# EAGLE design motorboard_2017 (EAGLE 8.4.3)
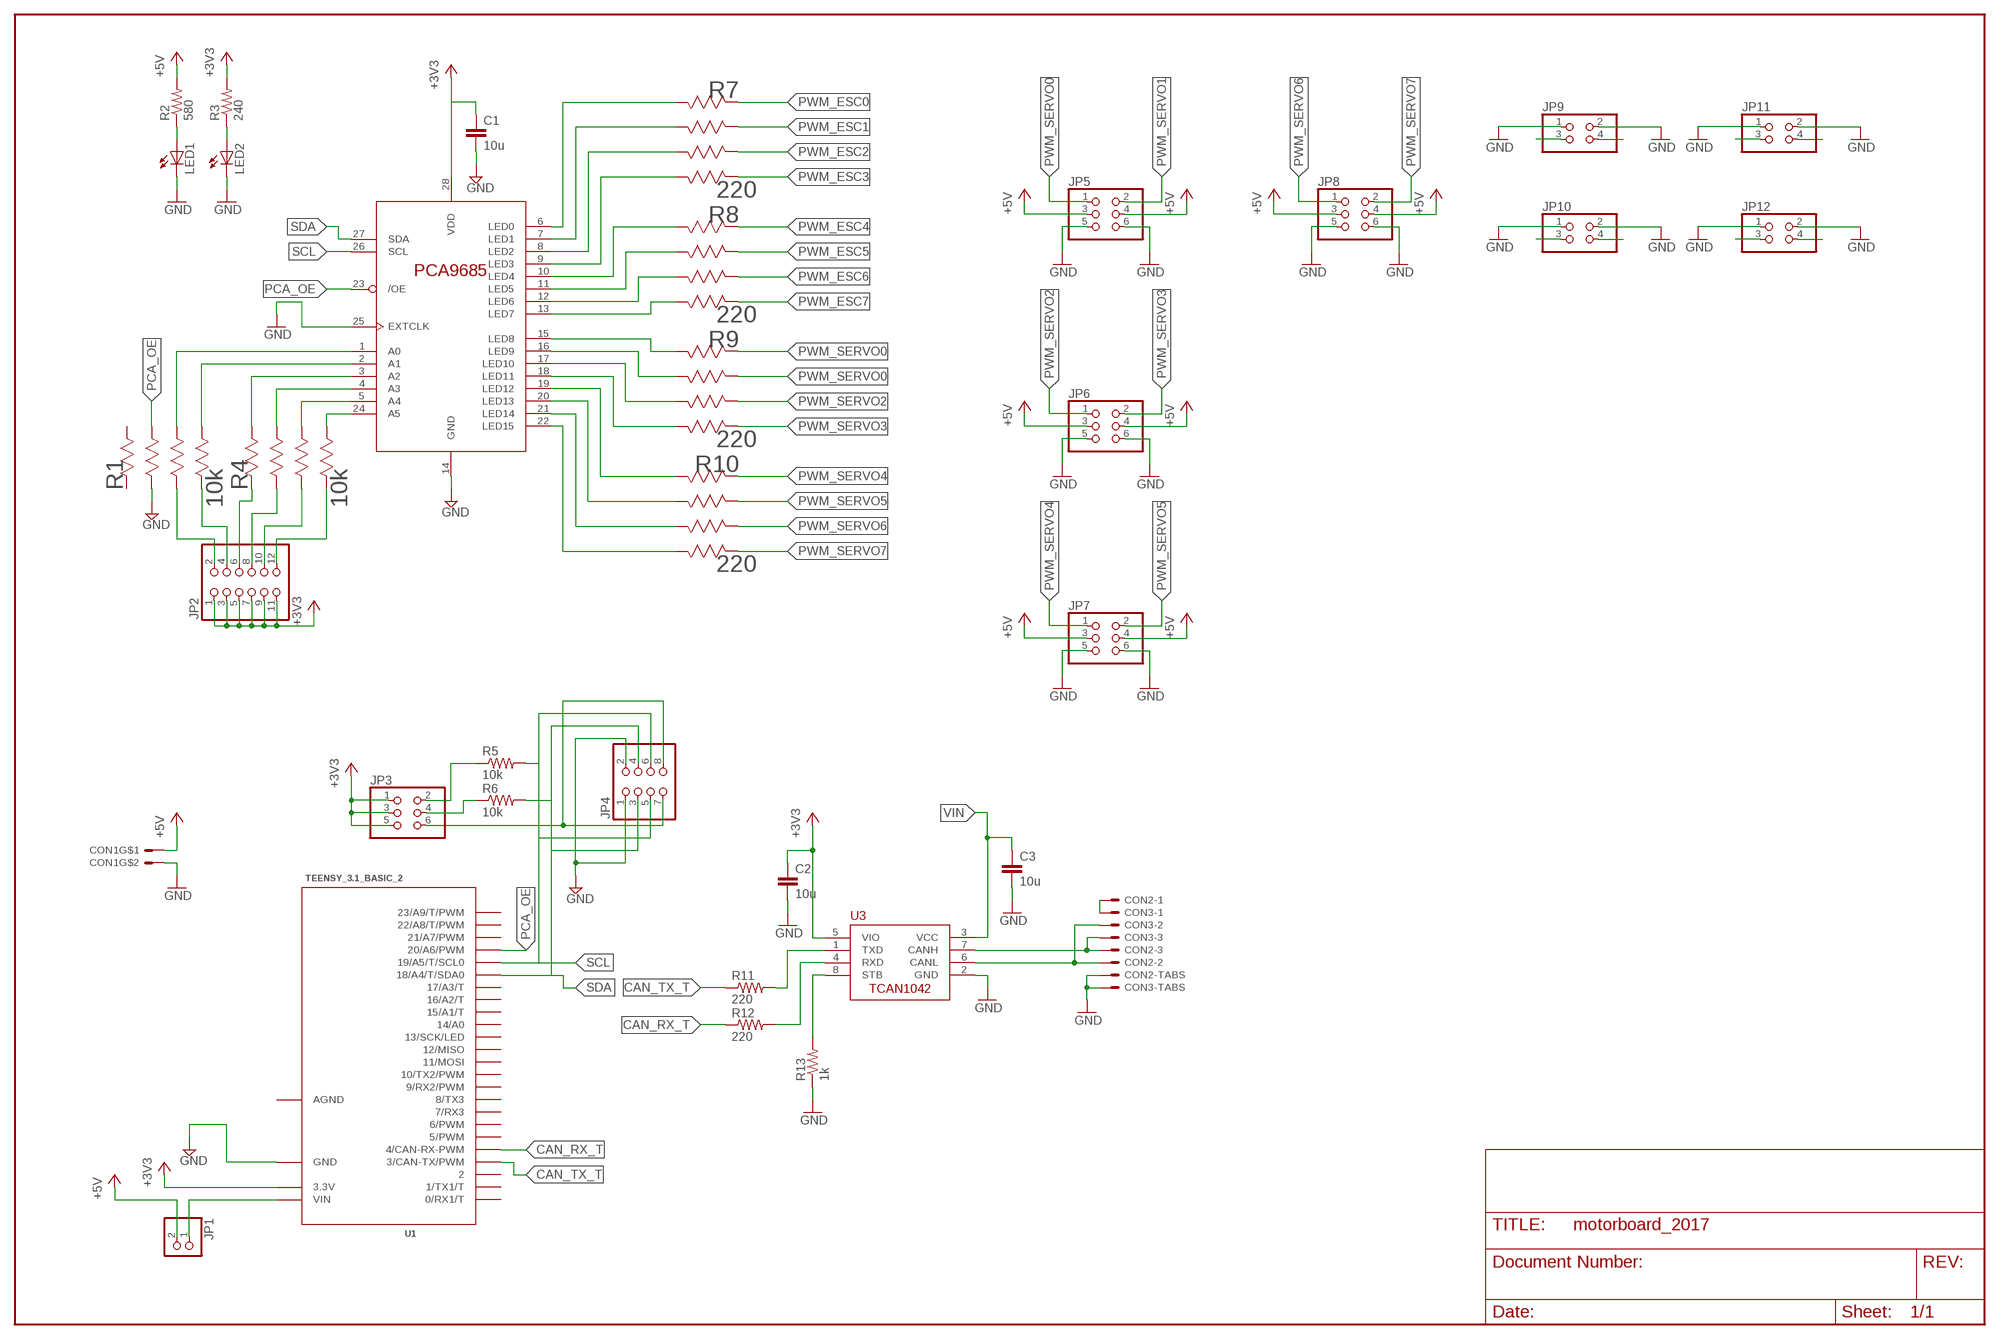
[diagram p0: schematic, sheet 1]

## Parts
C1  10u  C-EUC0805  [C0805]
C2  10u  C-EUC0805  [C0805]
C3  10u  C-EUC0805  [C0805]
CON1  MOLEX_5566-2  [5566-2]
CON2  SM03B-GHS-TB  [SM03B-GHS-TB]
CON3  SM03B-GHS-TB  [SM03B-GHS-TB]
JP1  PINHD-1X2  [1X02]
JP2  PINHD-2X6  [2X06]
JP3  PINHD-2X3  [2X03]
JP4  PINHD-2X4  [2X04]
JP5  PINHD-2X3  [2X03]
JP6  PINHD-2X3  [2X03]
JP7  PINHD-2X3  [2X03]
JP8  PINHD-2X3  [2X03]
JP9  PINHD-2X2  [2X02]
JP10  PINHD-2X2  [2X02]
JP11  PINHD-2X2  [2X02]
JP12  PINHD-2X2  [2X02]
LED1  LEDCHIPLED_1206  [CHIPLED_1206]
LED2  LEDCHIPLED_1206  [CHIPLED_1206]
R1  10k  EXB-V8V221JVEXBV8V-M  [EXBV8V-M]
R2  580  R-US_R1206  [R1206]
R3  240  R-US_R1206  [R1206]
R4  10k  EXB-V8V221JVEXBV8V-M  [EXBV8V-M]
R5  10k  R-US_R1206  [R1206]
R6  10k  R-US_R1206  [R1206]
R7  220  EXB-V8V221JVEXBV8V-M  [EXBV8V-M]
R8  220  EXB-V8V221JVEXBV8V-M  [EXBV8V-M]
R9  220  EXB-V8V221JVEXBV8V-M  [EXBV8V-M]
R10  220  EXB-V8V221JVEXBV8V-M  [EXBV8V-M]
R11  220  R-US_R0805  [R0805]
R12  220  R-US_R0805  [R0805]
R13  1k  R-US_R0805  [R0805]
U1  TEENSY_3.1_BASIC_2  [TEENSY_3.1_BASIC_2]
U2  PCA9685PW  [TSSOP28]
U3  TCAN1042HVDR  [SO-8]

## Nets
+3V3: C1.1 C2.1 JP2.1 JP2.3 JP2.5 JP2.7 JP2.9 JP2.11 JP3.1 JP3.3 JP3.5 R3.2 U1.3.3V U2.28(VDD) U3.5(VIO)
+5V: CON1.1 JP1.2 JP5.3 JP5.4 JP6.3 JP6.4 JP7.3 JP7.4 JP8.3 JP8.4 R2.2
A0: R1.6 U2.1(A0)
A0+1: JP2.2 R1.3
A1: R1.5 U2.2(A1)
A1+1: JP2.4 R1.4
A2: R4.8 U2.3(A2)
A2+1: JP2.6 R4.1
A3: R4.7 U2.4(A3)
A3+1: JP2.8 R4.2
A4: R4.6 U2.5(A4)
A4+1: JP2.10 R4.3
A5: R4.5 U2.24(A5)
A5+1: JP2.12 R4.4
CAN_RX1: R12.2 U3.4(RXD)
CAN_RX_T: R12.1 U1.4(4/CAN-RX-PWM)
CAN_TX2: R11.2 U3.1(TXD)
CAN_TX_T: R11.1 U1.3(3/CAN-TX/PWM)
CANH1: CON2.P$3 CON3.P$3 U3.7(CANH)
CANL1: CON2.P$2 CON3.P$2 U3.6(CANL)
CANSH1: CON2.P$1 CON3.P$1
GND: C1.2 C2.2 C3.2 CON1.2 CON2.P$4 CON2.P$5 CON3.P$4 CON3.P$5 JP4.1 JP4.2 JP5.5 JP5.6 JP6.5 JP6.6 JP7.5 JP7.6 JP8.5 JP8.6 JP9.1 JP9.2 JP10.1 JP10.2 JP11.1 JP11.2 JP12.1 JP12.2 LED1.C LED2.C R1.2 R13.1 U1.GND U2.14(GND) U2.25(EXTCLK) U3.2(GND)
I2C_3V1: JP3.6 JP4.7 JP4.8
N$1: LED2.A R3.1
N$2: LED1.A R2.1
PCA_OE: R1.7 U1.20/A6(20/A6/PWM) U2.23(/OE)
PWM_CH0: R7.8 U2.6(LED0)
PWM_CH1: R7.7 U2.7(LED1)
PWM_CH2: R7.6 U2.8(LED2)
PWM_CH3: R7.5 U2.9(LED3)
PWM_CH4: R8.8 U2.10(LED4)
PWM_CH5: R8.7 U2.11(LED5)
PWM_CH6: R8.6 U2.12(LED6)
PWM_CH7: R8.5 U2.13(LED7)
PWM_CH8: R9.8 U2.15(LED8)
PWM_CH9: R9.7 U2.16(LED9)
PWM_CH10: R9.6 U2.17(LED10)
PWM_CH11: R9.5 U2.18(LED11)
PWM_CH12: R10.8 U2.19(LED12)
PWM_CH13: R10.7 U2.20(LED13)
PWM_CH14: R10.6 U2.21(LED14)
PWM_CH15: R10.5 U2.22(LED15)
PWM_ESC0: JP12.4 R7.1
PWM_ESC1: JP12.3 R7.2
PWM_ESC2: JP9.4 R7.3
PWM_ESC3: JP9.3 R7.4
PWM_ESC4: JP11.4 R8.1
PWM_ESC5: JP11.3 R8.2
PWM_ESC6: JP10.4 R8.3
PWM_ESC7: JP10.3 R8.4
PWM_SERVO0: JP5.1 R9.1
PWM_SERVO1: JP5.2 R9.2
PWM_SERVO2: JP6.1 R9.3
PWM_SERVO3: JP6.2 R9.4
PWM_SERVO4: JP7.1 R10.1
PWM_SERVO5: JP7.2 R10.2
PWM_SERVO6: JP8.1 R10.3
PWM_SERVO7: JP8.2 R10.4
SCL: JP4.5 JP4.6 R5.2 U1.19/A5(19/A5/T/SCL0) U2.26(SCL)
SCL_3V1: JP3.2 R5.1
SDA: JP4.3 JP4.4 R6.2 U1.18/A4(18/A4/T/SDA0) U2.27(SDA)
SDA_3V1: JP3.4 R6.1
STB1: R13.2 U3.8(STB)
VIN: C3.1 JP1.1 U1.VIN U3.3(VCC)
Unconnected: R1.1 R1.8 U1.0(0/RX1/T) U1.1(1/TX1/T) U1.2 U1.5(5/PWM) U1.6(6/PWM) U1.7(7/RX3) U1.8(8/TX3) U1.9(9/RX2/PWM) U1.10(10/TX2/PWM) U1.11(11/MOSI) U1.12(12/MISO) U1.13(13/SCK/LED) U1.14/A0 U1.15/A1(15/A1/T) U1.16/A2(16/A2/T) U1.17/A3(17/A3/T) U1.21/A7(21/A7/PWM) U1.22/A8(22/A8/T/PWM) U1.23/A9(23/A9/T/PWM)

## Power pins joined to a net without a drawn wire
AGND: U1.AGND

## Library data of the parts
C1-C3 = rcl:C-EU: CAPACITOR, European symbol
CON1 = ARVP:MOLEX_5566-2
CON2 CON3 = ARVP:SM03B-GHS-TB
JP1 = pinhead:PINHD-1X2: PIN HEADER
JP2 = pinhead:PINHD-2X6: PIN HEADER
JP3 JP5-JP8 = pinhead:PINHD-2X3: PIN HEADER
JP4 = pinhead:PINHD-2X4: PIN HEADER
JP9-JP12 = pinhead:PINHD-2X2: PIN HEADER
LED1 LED2 = led:LED: LED OSRAM: - CHIPLED LG R971, LG N971, LY N971, LG Q971, LY Q971, LO R971, LY R971 LH N974, LH R974 LS Q976, LO Q976, LY Q976 LO Q996 - Hyper CHIPLED LW Q18S LB Q993, LB Q99A, LB R99A - SideLED LS A670, LO A670, LY A670, LG A670, LP A670 LB A673, LV A673, LT A673, LW A673 LH A674 LY A675 LS A676, LA A676, LO A676, LY A676, LW A676 LS A679, LY A679, LG A679 - Hyper Micro SIDELED® LS Y876, LA Y876, LO Y876, LY Y876 LT Y87S - SmartLED LW L88C, LW L88S LB L89C, LB L89S, LG L890 LS L89K, LO L89K, LY L89K LS L896, LA L896, LO L896, LY L896 - TOPLED LS T670, LO T670, LY T670, LG T670, LP T670 LSG T670, LSP T670, LSY T670, LOP T670, LYG T670 LG T671, LOG T671, LSG T671 LB T673, LV T673, LT T673, LW T673 LH T674 LS T676, LA T676, LO T676, LY T676, LB T676, LH T676, LSB T676, LW T676 LB T67C, LV T67C, LT T67C, LS T67K, LO T67K, LY T67K, LW E67C LS E67B, LA E67B, LO E67B, LY E67B, LB E67C, LV E67C, LT E67C LW T67C LS T679, LY T679, LG T679 LS T770, LO T770, LY T770, LG T770, LP T770 LB T773, LV T773, LT T773, LW T773 LH T774 LS E675, LA E675, LY E675, LS T675 LS T776, LA T776, LO T776, LY T776, LB T776 LHGB T686 LT T68C, LB T68C - Hyper Mini TOPLED® LB M676 - Mini TOPLED Santana® LG M470 LS M47K, LO M47K, LY M47K Source: http://www.osram.convergy.de LUXEON: - LUMILED® LXK2-PW12-R00, LXK2-PW12-S00, LXK2-PW14-U00, LXK2-PW14-V00 LXK2-PM12-R00, LXK2-PM12-S00, LXK2-PM14-U00 LXK2-PE12-Q00, LXK2-PE12-R00, LXK2-PE12-S00, LXK2-PE14-T00, LXK2-PE14-U00 LXK2-PB12-K00, LXK2-PB12-L00, LXK2-PB12-M00, LXK2-PB14-N00, LXK2-PB14-P00, LXK2-PB14-Q00 LXK2-PR12-L00, LXK2-PR12-M00, LXK2-PR14-Q00, LXK2-PR14-R00 LXK2-PD12-Q00, LXK2-PD12-R00, LXK2-PD12-S00 LXK2-PH12-R00, LXK2-PH12-S00 LXK2-PL12-P00, LXK2-PL12-Q00, LXK2-PL12-R00 Source: www.luxeon.com KINGBRIGHT: KA-3528ASYC Source: www.kingbright.com
R1 R4 R7-R10 = ARVP:EXB-V8V221JV; MANUFACTURER_PART_NUMBER: EXBV8V221JV; VENDOR: Panasonic
R2 R3 R5 R6 R11-R13 = rcl:R-US_: RESISTOR, American symbol
U1 = Teensy_3_Series_Board_v1.0:TEENSY_3.1_BASIC_2: Footprint for Teensy 3.1 board using all pin connections on the outer perimeter
U2 = dropper_torpedo_v3:PCA9685
U3 = ARVP:TCAN1042HVDR

## Net classes
1 net1: clearance 0.203 mm to class 0

## Board
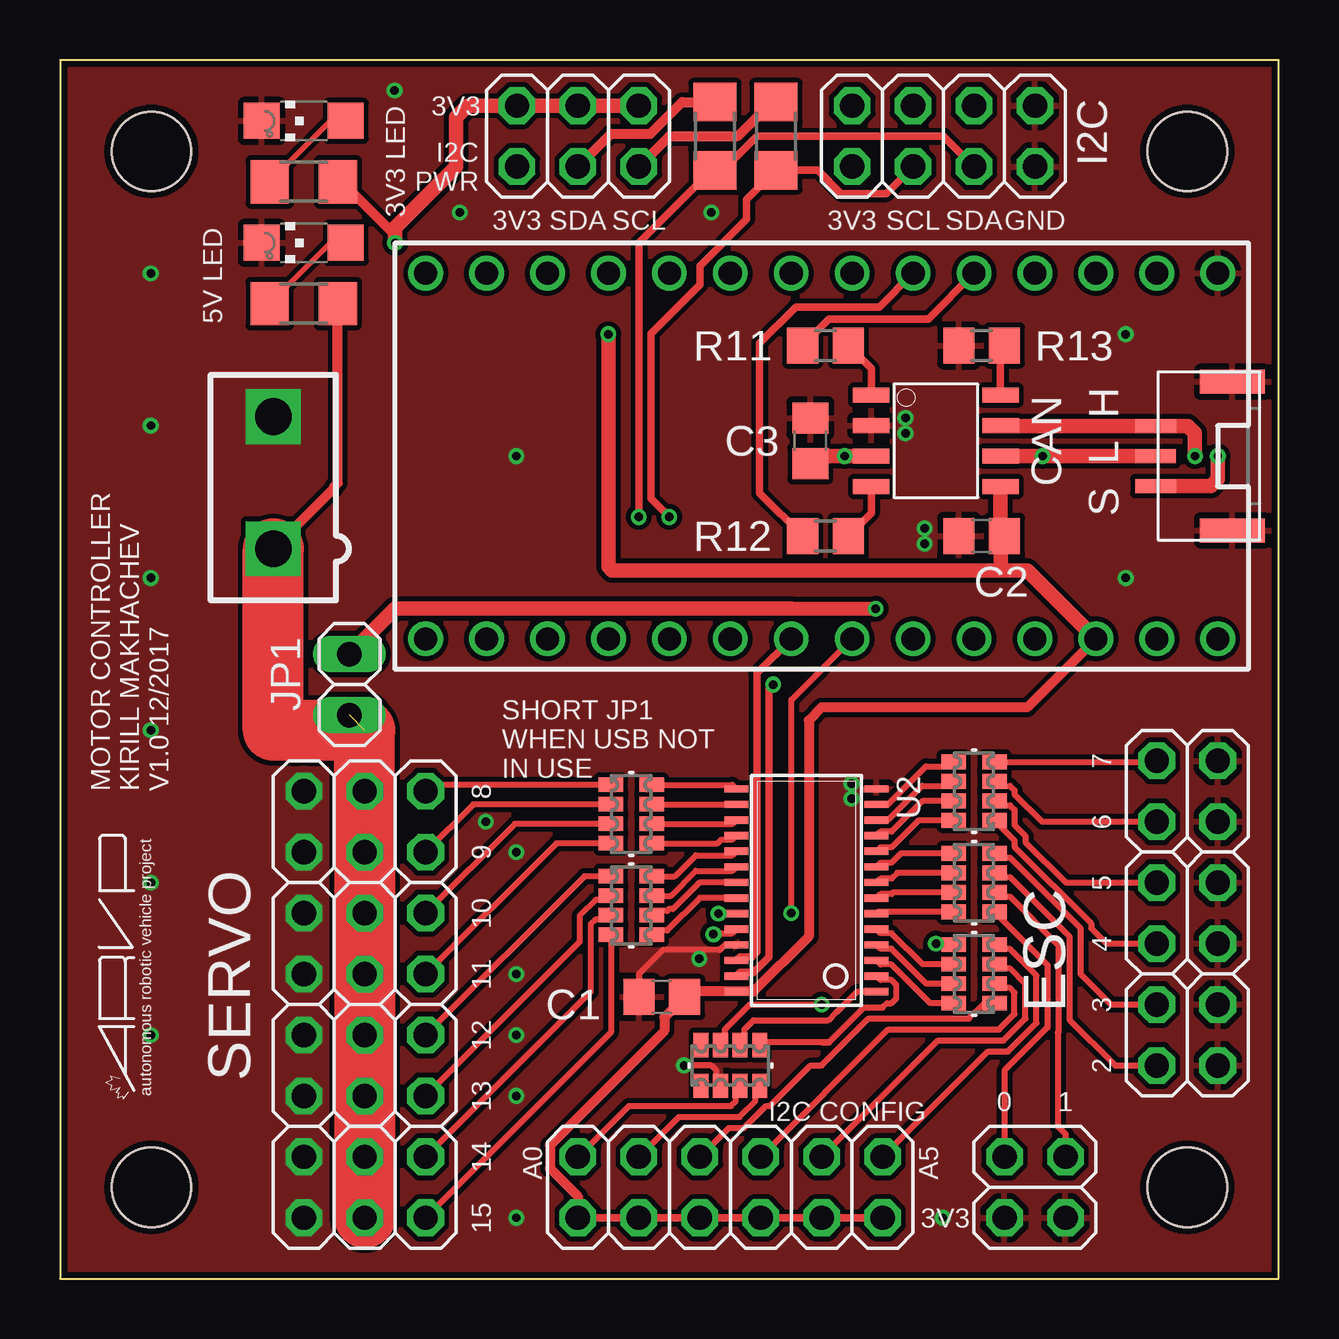
[diagram p1: board, top side]
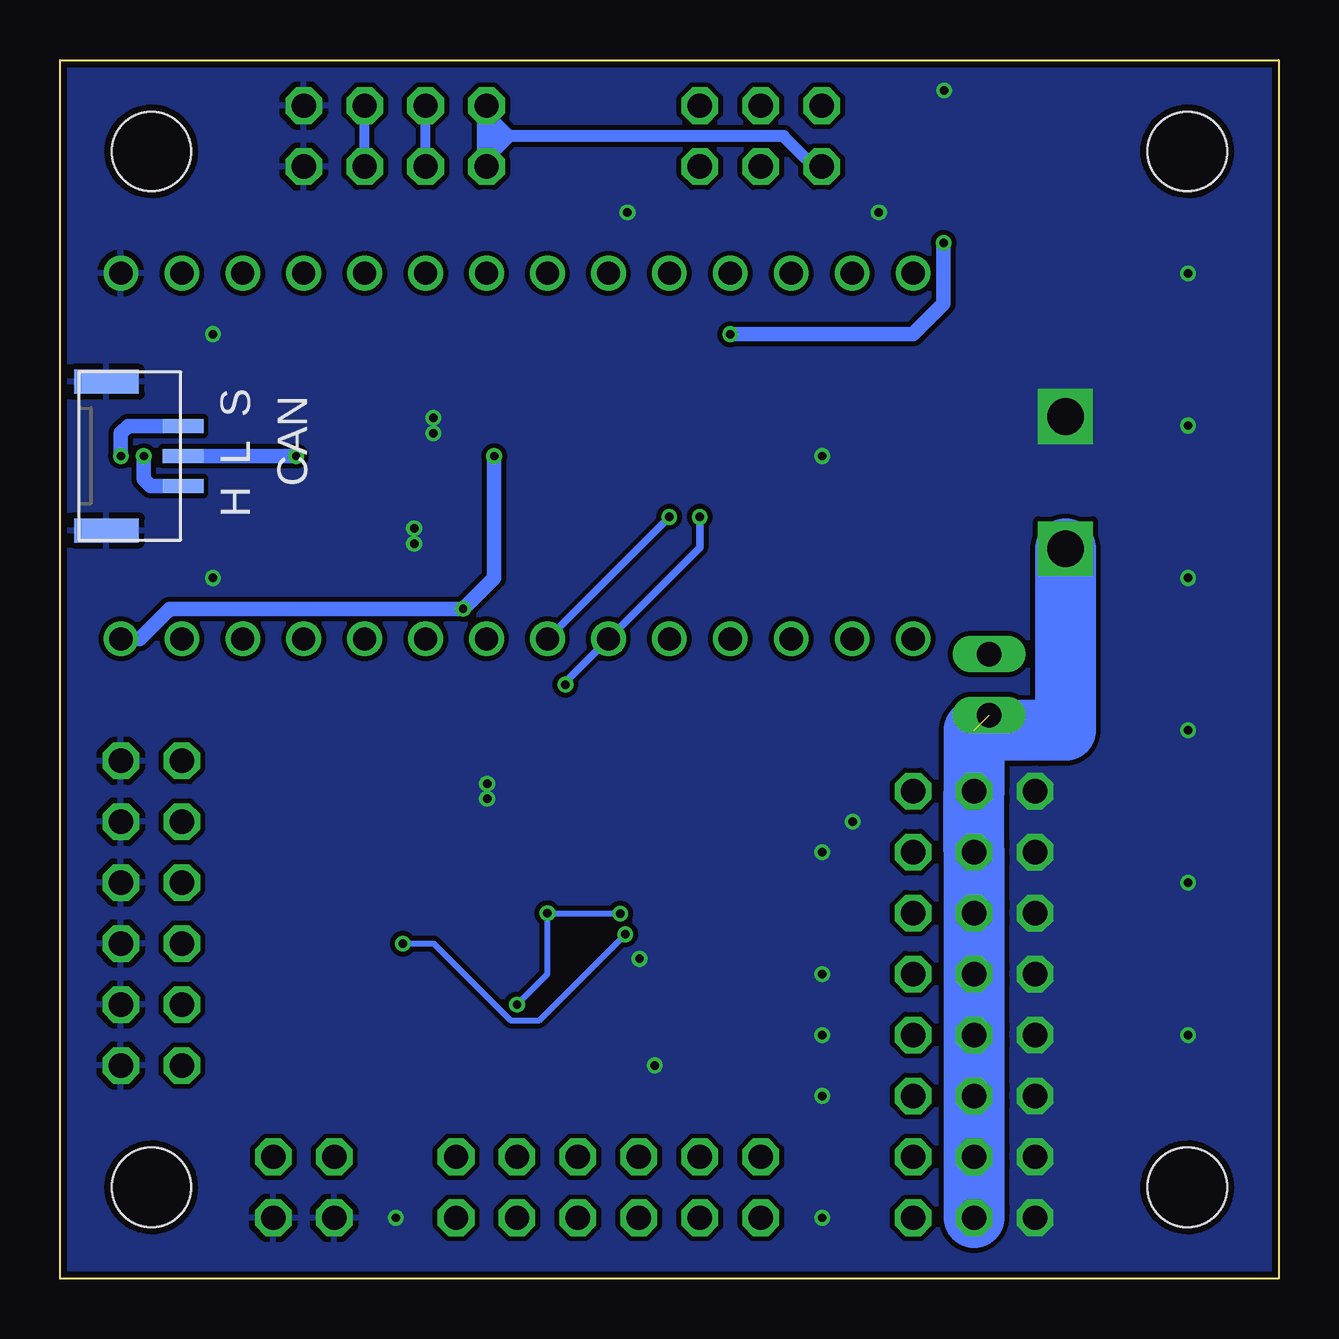
[diagram p2: board, bottom side, seen from below]

Size 50.8 x 50.8 mm. Coordinates in mm from the lower left corner, seen from the top.
Outline: 0,0 50.8,0 50.8,50.8 0,50.8 0,0
Copper layers (1*16): Top 0.035mm / dielectric 1.5mm / Bottom 0.035mm
Design rules "ITEADstudioDRC": minimum track width 6mil, minimum drill 12mil, track to track 8mil, track to pad 8mil, pad to pad 8mil, via to via 8mil, smd to smd 0mil, copper to edge 10mil, drill to drill 10mil, minimum pad ring 6mil, minimum via ring 6mil, stop-mask expansion 2mil, vias tented up to drill 100mil, thermal gap 10mil
Milling: 4 lines

### Footprints (pad centres in the part's own frame; a part is rotated, then mirrored left to right if it is on the bottom)
C0805 = smd 1.3 x 1.5: 1 -0.95,0; 2 0.95,0
5566-2 = drill 1.524 square: 1 0,-2.756; 2 0,2.756
SM03B-GHS-TB = smd 0.6 x 1.7: P$1 -1.25,0.85; P$2 0,0.85; P$3 1.25,0.85 | smd 1 x 2.7: P$4 -3.1,-2.35; P$5 3.1,-2.35
1X02 = drill 1.016 long: 1 -1.27,0; 2 1.27,0
2X06 = drill 1.016 octagon: 1 -6.35,-1.27; 2 -6.35,1.27; 3 -3.81,-1.27; 4 -3.81,1.27; 5 -1.27,-1.27; 6 -1.27,1.27; 7 1.27,-1.27; 8 1.27,1.27; 9 3.81,-1.27; 10 3.81,1.27; 11 6.35,-1.27; 12 6.35,1.27
2X03 = drill 1.016 octagon: 1 -2.54,-1.27; 2 -2.54,1.27; 3 0,-1.27; 4 0,1.27; 5 2.54,-1.27; 6 2.54,1.27
2X04 = drill 1.016 octagon: 1 -3.81,-1.27; 2 -3.81,1.27; 3 -1.27,-1.27; 4 -1.27,1.27; 5 1.27,-1.27; 6 1.27,1.27; 7 3.81,-1.27; 8 3.81,1.27
2X02 = drill 1.016 octagon: 1 -1.27,-1.27; 2 -1.27,1.27; 3 1.27,-1.27; 4 1.27,1.27
CHIPLED_1206 = smd 1.5 x 1.5: A 0,-1.75; C 0,1.75
EXBV8V-M = smd 1.016 x 0.61: 1 -0.851,1.219; 2 -0.851,0.406; 3 -0.851,-0.406; 4 -0.851,-1.219; 5 0.851,-1.219; 6 0.851,-0.406; 7 0.851,0.406; 8 0.851,1.219
R1206 = smd 1.6 x 1.803: 1 -1.422,0; 2 1.422,0
R0805 = smd 1.3 x 1.5: 1 -0.95,0; 2 0.95,0
TEENSY_3.1_BASIC_2 = drill 0.965: 0 -7.62,13.97; 1 -7.62,11.43; 2 -7.62,8.89; 3 -7.62,6.35; 3.3V 7.62,11.43; 4 -7.62,3.81; 5 -7.62,1.27; 6 -7.62,-1.27; 7 -7.62,-3.81; 8 -7.62,-6.35; 9 -7.62,-8.89; 10 -7.62,-11.43; 11 -7.62,-13.97; 12 -7.62,-16.51; 13 7.62,-16.51; 14/A0 7.62,-13.97; 15/A1 7.62,-11.43; 16/A2 7.62,-8.89; 17/A3 7.62,-6.35; 18/A4 7.62,-3.81; 19/A5 7.62,-1.27; 20/A6 7.62,1.27; 21/A7 7.62,3.81; 22/A8 7.62,6.35; 23/A9 7.62,8.89; AGND 7.62,13.97; GND -7.62,16.51; VIN 7.62,16.51
TSSOP28 = smd 0.305 x 0.991: 1 -4.225,-2.918; 2 -3.575,-2.918; 3 -2.925,-2.918; 4 -2.275,-2.918; 5 -1.625,-2.918; 6 -0.975,-2.918; 7 -0.325,-2.918; 8 0.325,-2.918; 9 0.975,-2.918; 10 1.625,-2.918; 11 2.275,-2.918; 12 2.925,-2.918; 13 3.575,-2.918; 14 4.225,-2.918; 15 4.225,2.918; 16 3.575,2.918; 17 2.925,2.918; 18 2.275,2.918; 19 1.625,2.918; 20 0.975,2.918; 21 0.325,2.918; 22 -0.325,2.918; 23 -0.975,2.918; 24 -1.625,2.918; 25 -2.275,2.918; 26 -2.925,2.918; 27 -3.575,2.918; 28 -4.225,2.918
SO-8 = smd 1.524 x 0.61: 1 -2.692,1.905; 2 -2.692,0.635; 3 -2.692,-0.635; 4 -2.692,-1.905; 5 2.692,-1.905; 6 2.692,-0.635; 7 2.692,0.635; 8 2.692,1.905
STAND-OFF = hole 3.302: 0,0

### Placement (x,y rotation side)
C1  25.08,11.75 180 top
C2  38.42,30.96 180 top
C3  31.27,34.93 90 top
CON1  8.89,33.18 0 top
CON2  46.51,34.29 90 top
CON3  46.51,34.29 270 bottom
JP1  12.06,24.77 270 top
JP2  27.94,3.81 0 top
JP3  21.59,47.62 180 top
JP4  36.83,47.62 180 top
JP5  12.7,19.05 180 top
JP6  12.7,13.97 180 top
JP7  12.7,8.89 180 top
JP8  12.7,3.81 180 top
JP9  46.99,10.16 180 top
JP10  46.99,20.32 180 top
JP11  46.99,15.24 180 top
JP12  40.64,3.81 90 top
LED1  10.16,43.18 90 top
LED2  10.16,48.26 90 top
R1  27.94,8.89 90 top
R2  10.16,40.64 0 top
R3  10.16,45.72 0 top
R4  38.1,12.7 180 top
R5  29.84,47.62 270 top
R6  27.3,47.62 270 top
R7  38.1,16.51 180 top
R8  38.1,20.32 180 top
R9  23.81,19.37 0 top
R10  23.81,15.56 0 top
R11  31.91,38.89 0 top
R12  31.91,30.96 0 top
R13  38.42,38.89 0 top
U1  31.75,34.29 270 top
U2  31.11,16.19 90 top
U3  36.51,34.93 0 top
U$1  [LOGO2]  3.81,7.62 90 top
U$2  [STAND-OFF]  46.99,3.81 0 top
U$3  [STAND-OFF]  3.81,3.81 0 top
U$4  [STAND-OFF]  3.81,46.99 0 top
U$5  [STAND-OFF]  46.99,46.99 0 top
U$11  [LETTER_L]  -107.95,-78.74 0 top  (outside the outline)
U$12  [DOCFIELD]  39.37,-78.74 0 top  (outside the outline)

### Tracks (layer width: path | path; a pad name or v marks a point on that pad's centre or on a via)
+3V3  (via drill 0.35)
  Top 0.254: C1.1 26.25,11.97 26.35,11.97 U2.28
  Top 0.305: JP2.1 JP2.3 JP2.5 JP2.7 JP2.9 JP2.11
  Top 0.406: U1.3.3V 40.32,23.81 31.75,23.81 31.21,23.28 31.21,14.28 28.91,11.97 26.35,11.97 | C1.1 25.19,10.9 25.19,10.33 20.42,5.56 20.42,4.6 21.59,3.43 JP2.1 | v13.97,43.18 13.97,43.5 11.75,45.72 R3.2
  Top 0.61: v13.97,43.18 13.97,43.82 16.51,46.36 16.51,48.42 16.99,48.9 JP3.5 JP3.3 JP3.1 | 39.2,31.12 U3.5 | 39.2,31.12 C2.1 39.21,30.8 39.21,29.53 | 39.2,30.96 39.2,31.12 | U1.3.3V 40.32,29.53 39.21,29.53 | 39.21,29.53 23.02,29.53 22.86,29.69 v22.86,39.37
  Bottom 0.61: v13.97,43.18 13.97,40.64 15.24,39.37 v22.86,39.37
+5V  (1 unrouted)
  Top 0.406: CON1.1 11.43,32.96 11.43,33.02 11.58,33.17 R2.2
  Top 2.54: JP8.4 JP8.3 JP7.4 JP7.3 JP6.4 JP6.3 JP5.4 JP5.3 12.7,22.86 8.89,22.86 CON1.1
  Bottom 2.54: JP8.4 JP8.3 JP7.4 JP7.3 JP6.4 JP6.3 JP5.4 JP5.3 12.7,22.86 8.89,22.86 CON1.1
A0
  Top 0.254: R1.6 28.52,9.92 28.52,10.39 28.91,10.77 32.02,10.77 32.36,11.11 32.39,11.11 33.24,11.97 U2.1
A0+1
  Top 0.254: R1.3 28.17,7.86 28.17,7.39 27.98,7.2 23.71,7.2 JP2.2
A1
  Top 0.254: R1.5 29.26,9.84 31.75,9.84 | 32.06,9.84 31.75,9.84 | 31.75,9.84 32.06,9.84 | 32.06,9.84 33.52,11.3 34.29,11.3 34.47,11.48 34.67,11.48 34.86,11.68 34.86,12.26 34.67,12.45 34.2,12.45 U2.2
A1+1
  Top 0.254: JP2.4 25.79,6.74 28.33,6.74 28.98,7.39 28.98,7.86 R1.4
A2
  Top 0.254: U2.3 34.2,13.1 34.67,13.1 36.28,11.48 R4.8
A2+1
  Top 0.254: JP2.6 27.88,6.29 28.52,6.29 29.43,7.2 29.6,7.2 31.29,8.89 31.75,8.89 33.71,10.85 37.89,10.85 38.53,11.48 R4.1
A3
  Top 0.254: U2.4 34.2,13.75 34.67,13.75 36.12,12.29 R4.7
A3+1
  Top 0.254: JP2.8 34.52,10.39 39.14,10.39 39.79,11.04 39.79,11.92 39.6,12.12 39.13,12.12 R4.2
A4
  Top 0.254: U2.5 34.2,14.4 34.67,14.4 35.96,13.11 R4.6
A4+1
  Top 0.254: JP2.10 36.6,9.93 39.33,9.93 40.25,10.85 40.25,12.28 39.6,12.93 39.13,12.93 R4.3
A5  (via drill 0.35)
  Top 0.254: R4.5 36.56,13.92 v36.51,13.97 | v27.24,14.36 27.52,14.36 27.56,14.4 28.03,14.4 U2.24
  Bottom 0.254: v36.51,13.97 35.22,13.97 32.02,10.77 30.82,10.77 v27.24,14.36
A5+1
  Top 0.254: JP2.12 38.68,9.47 39.52,9.47 40.7,10.66 40.7,12.63 39.6,13.74 39.13,13.74 R4.4
CAN_RX1
  Top 0.305: U3.4 33.82,31.92 R12.2
CAN_RX_T
  Top 0.305: U1.4 34.16,40.51 30.67,40.51 29.16,39 29.16,32.75 R12.1
CAN_TX2
  Top 0.305: U3.1 33.82,37.93 R11.2
CAN_TX_T
  Top 0.305: U1.3 36.19,40 32.06,40 31.85,39.79 R11.1
CANH1  (via drill 0.35)
  Top 0.61: U3.7 39.23,35.54 CON2.P$3 47.01,35.54 47.31,35.24 v47.31,34.29
  Bottom 0.61: v47.31,34.29 47.31,33.34 47.01,33.04 CON3.P$3
CANL1  (via drill 0.35)
  Top 0.61: U3.6 v40.96,34.29 CON3.P$2
  Bottom 0.61: v40.96,34.29 CON3.P$2
CANSH1  (via drill 0.35)
  Top 0.61: v48.26,34.29 48.26,33.34 47.96,33.04 CON2.P$1
  Bottom 0.61: CON3.P$1 47.96,35.54 48.26,35.24 v48.26,34.29
GND  (via drill 0.35)
  Top 0.254: R1.2 27.36,8.22 27.36,8.68 27.15,8.89 v26.01,8.89 | U2.25 27.73,13.92 27.51,13.7 25.13,13.7 24.13,12.7 C1.2
  other vias: 36.04,31.27 36.04,30.64 35.24,35.88 35.24,35.24 16.67,44.45 27.15,44.45 19.02,12.7 19.02,10.16 19.02,7.62 19.02,17.78 17.75,19.05 26.64,13.34 19.02,2.54 36.8,2.54 32.99,20.64 32.99,20 13.94,49.53 3.78,22.86 3.78,16.51 3.78,10.16 19.02,34.29 44.42,39.37 44.42,29.21 3.78,29.21 3.78,35.56 3.78,41.91
  pour Bottom (rank 2): 0.32,0.32 50.48,0.32 50.48,50.48 0.32,50.48
  pour Top (rank 3): 0.32,0.32 50.48,0.32 50.48,50.48 0.32,50.48
  pour Top (no thermals): 8.89,21.59 11.43,21.59 11.43,1.27 8.89,1.27
  pour Bottom (no thermals): 8.89,21.59 11.43,21.59 11.43,1.27 8.89,1.27
  pour Bottom (no thermals): 6.98,37.47 10.8,37.47 10.8,34.29 6.98,34.29
  pour Top (no thermals): 6.98,37.47 10.8,37.47 10.8,34.29 6.98,34.29
I2C_3V1
  Bottom 0.508: JP3.6 19.37,46.36 20.64,47.62 33.02,47.62 | 33.02,48.58 32.07,47.62 33.02,46.67
  Bottom 0.813: JP4.7 33.02,48.58 33.02,47.62 33.02,46.67 JP4.8
N$1
  Top 0.203: LED2.A 11.28,48.26 R3.1
N$2
  Top 0.203: LED1.A 11.28,43.18 R2.1
PCA_OE  (via drill 0.35)
  Top 0.254: v27.45,15.22 U2.23 | v30.48,15.24 30.48,24.13 U1.20/A6 | R1.7 27.71,9.92 27.71,10.39 28.76,11.43 v31.75,11.43
  Bottom 0.254: v31.75,11.43 30.48,12.7 v30.48,15.24 30.46,15.22 v27.45,15.22
PWM_CH0
  Top 0.254: R7.8 34.11,15.29 U2.6
PWM_CH1
  Top 0.254: R7.7 34.73,16.1 34.67,16.04 34.2,16.04 U2.7
PWM_CH2
  Top 0.254: U2.8 34.2,16.69 34.67,16.69 34.9,16.92 R7.6
PWM_CH3
  Top 0.254: U2.9 34.2,17.34 34.67,17.34 35.06,17.73 R7.5
PWM_CH4
  Top 0.254: U2.10 34.2,17.98 34.67,17.98 35.78,19.1 R8.8
PWM_CH5
  Top 0.254: U2.11 34.2,18.64 34.67,18.64 35.94,19.91 R8.7
PWM_CH6
  Top 0.254: U2.12 34.5,19.12 35.93,20.55 37.07,20.55 R8.6
PWM_CH7
  Top 0.254: U2.13 34.5,19.77 36.1,21.36 37.07,21.36 R8.5
PWM_CH8
  Top 0.254: R9.8 28.03,20.59 U2.15
PWM_CH9
  Top 0.254: R9.7 U2.16
PWM_CH10
  Top 0.254: R9.6 28.04,18.96 U2.17
PWM_CH11
  Top 0.254: R9.5 27.41,18.15 27.56,18.3 28.03,18.3 U2.18
PWM_CH12
  Top 0.254: R10.8 25.63,16.78 26.5,17.65 28.03,17.65 U2.19
PWM_CH13
  Top 0.254: R10.7 25.46,15.96 26.5,17 28.03,17 U2.20
PWM_CH14
  Top 0.254: U2.21 26.66,16.52 25.55,15.41 25.39,15.41 25.31,15.33 24.84,15.33 R10.6
PWM_CH15
  Top 0.254: U2.22 27.73,15.87 27.72,15.88 26.67,15.88 25.31,14.52 24.84,14.52 R10.5
PWM_ESC0
  Top 0.254: JP12.4 39.37,8.68 41.16,10.47 41.16,13.08 R7.1
PWM_ESC1
  Top 0.254: R7.2 39.13,15.93 39.6,15.93 41.62,13.9 41.62,10.28 41.59,10.26 41.59,6.35 41.91,6.03 JP12.3
PWM_ESC2
  Top 0.254: R7.3 39.13,16.74 39.6,16.74 42.08,14.26 42.08,10.8 43.98,8.89 JP9.4
PWM_ESC3
  Top 0.254: R7.4 39.13,17.55 39.6,17.55 42.53,14.62 42.53,12.7 43.8,11.43 JP9.3
PWM_ESC4
  Top 0.254: R8.1 39.79,18.26 39.79,18.01 42.99,14.8 42.99,14.61 43.62,13.97 JP11.4
PWM_ESC5
  Top 0.254: R8.2 39.13,19.74 39.6,19.74 39.79,19.54 39.79,18.91 40.25,18.45 40.25,18.19 41.93,16.51 JP11.3
PWM_ESC6
  Top 0.254: R8.3 39.13,20.55 39.6,20.55 39.79,20.36 39.79,20.19 40.93,19.05 JP10.4
PWM_ESC7
  Top 0.254: R8.4 45.67,21.54 JP10.3
PWM_SERVO0
  Top 0.254: R9.1 15.51,20.59 JP5.1
PWM_SERVO1
  Top 0.254: R9.2 17.23,19.77 JP5.2
PWM_SERVO2
  Top 0.254: R9.3 18.96,18.96 JP6.1
PWM_SERVO3
  Top 0.254: R9.4 20.69,18.15 JP6.2
PWM_SERVO4
  Top 0.254: R10.1 21.86,16.78 JP7.1
PWM_SERVO5
  Top 0.254: JP7.2 21.67,14.05 21.67,15.14 22.32,15.79 22.78,15.79 R10.2
PWM_SERVO6
  Top 0.254: R10.3 22.78,14.97 22.32,14.97 22.12,14.78 22.12,11.96 JP8.1
PWM_SERVO7
  Top 0.254: R10.4 22.96,10.26 JP8.2
SCL  (via drill 0.35)
  Top 0.305: v25.4,31.75 24.64,32.51 24.64,39.4 26.67,41.43 26.67,42.21 28.62,44.17 28.62,44.98 R5.2 31.59,46.2 32.56,45.24 34.44,45.24 JP4.6 | U2.26 28.34,13.41 28.84,13.41 29.05,13.62 29.05,25.24 U1.19/A5
  Bottom 0.305: v25.4,31.75 U1.19/A5
  Bottom 0.406: JP4.6 JP4.5
SCL_3V1
  Top 0.406: JP3.2 25.4,47.62 28.26,47.62 29.68,49.05 R5.1
SDA  (via drill 0.35)
  Top 0.305: v24.13,31.75 24.13,43.18 27.15,46.2 R6.2 27.63,46.2 29.05,47.62 36.83,47.62 JP4.4 | v29.73,24.77 29.56,24.59 29.56,13.41 28.91,12.76 28.34,12.76 U2.27
  Bottom 0.305: v24.13,31.75 24.13,30.48 U1.18/A4 29.73,24.88 v29.73,24.77
  Bottom 0.406: JP4.4 JP4.3
SDA_3V1
  Top 0.406: JP3.4 22.96,47.73 24.61,47.73 25.93,49.05 R6.1
STB1
  Top 0.305: R13.2 39.2,38.73 U3.8
VIN  (via drill 0.35)  (1 unrouted)
  Top 0.61: C3.1 31.43,34.29 v32.7,34.29 U3.3 33.97,34.29 | JP1.1 13.97,27.94 30.49,27.94 v34,27.93
  Bottom 0.61: U1.VIN 47.48,26.67 46.24,27.92 v34,27.92 32.7,29.21 v32.7,34.29

### Text on the board
tNames: 3V3 LED | 3V3 | I2C | I2C / PWR | 5V LED | 3V3 | SDA | SCL | 3V3 | SCL | SDA | GND | H | CAN | L | S | SHORT JP1 / WHEN USB NOT / IN USE | 7 | MOTOR CONTROLLER / KIRILL MAKHACHEV / V1.0 12/2017 | 8 | 6 | 9 | 5 | 10 | 4 | 11 | ESC | 3 | 12 | 2 | SERVO | 13 | I2C CONFIG | 0 | 1 | 14 | A0 | A5 | 15 | 3V3
bNames: S | CAN | L | H